# EAGLE design connector (EAGLE 9.6.2)
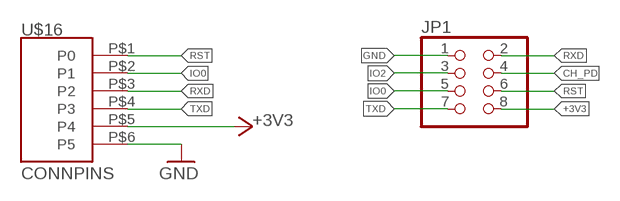
[diagram p0: schematic, sheet 1]

## Parts
JP1  PINHD-2X4  [2X04]
U$16  CONNPINS  [PINS]

## Nets
+3V3 [VCC]: JP1.8 U$16.P$5(P4)
CH_PD: JP1.4
GND [GND]: JP1.1 U$16.P$6(P5)
IO0: JP1.5 U$16.P$2(P1)
IO2: JP1.3
RST: JP1.6 U$16.P$1(P0)
RXD: JP1.2 U$16.P$3(P2)
TXD: JP1.7 U$16.P$4(P3)

## Library data of the parts
JP1 = pinhead:PINHD-2X4: PIN HEADER
U$16 = CONN:CONN

## Net classes
0 default: width 0.2 mm
1 VCC: width 0.25 mm
2 GND: width 0.3 mm
3 ANT: width 0.3 mm

## Board
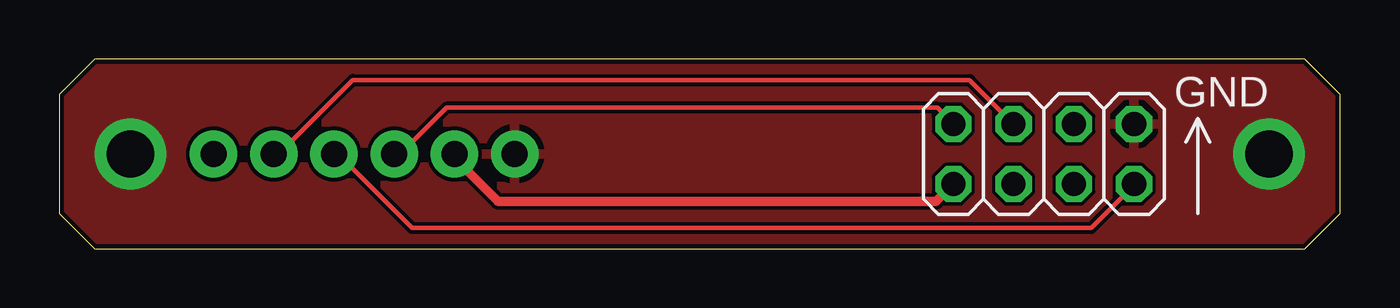
[diagram p1: board, top side]
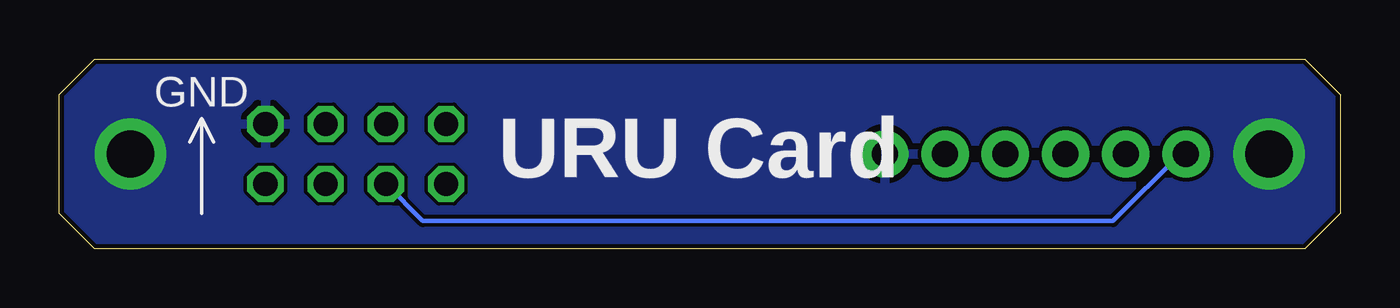
[diagram p2: board, bottom side, seen from below]

Size 54 x 8 mm. Coordinates in mm from the lower left corner, seen from the top.
Outline: 0,1.5 1.5,0 52.5,0 54,1.5 54,6.5 52.5,8 1.5,8 0,6.5 0,1.5
Copper layers (1*16): Top 0.035mm / dielectric 1.5mm / Bottom 0.035mm
Design rules "pcbway-5mil": minimum track width 6mil, minimum drill 0.3mm, track to track 6mil, track to pad 6mil, pad to pad 6mil, via to via 6mil, smd to smd 6mil, copper to edge 0.2mm, drill to drill 6mil, minimum pad ring 3mil, minimum via ring 3mil, stop-mask expansion 4mil, vias tented up to drill 0.5mm, thermal gap 10mil

### Footprints (pad centres in the part's own frame; a part is rotated, then mirrored left to right if it is on the bottom)
2X04 = drill 1.016 octagon: 1 -3.81,-1.27; 2 -3.81,1.27; 3 -1.27,-1.27; 4 -1.27,1.27; 5 1.27,-1.27; 6 1.27,1.27; 7 3.81,-1.27; 8 3.81,1.27
PINS = drill 1.1 pad 2: P$1 0,0; P$2 2.54,0; P$3 5.08,0; P$4 7.62,0; P$5 10.16,0; P$6 12.7,0

### Placement (x,y rotation side)
JP1  41.5,4 180 top
U$16  6.5,4 0 top

### Tracks (layer width: path | path; a pad name or v marks a point on that pad's centre or on a via)
+3V3
  Top 0.4: JP1.8 36.96,2 18.5,2 16.66,3.84 U$16.P$5
GND  (via drill 2)
  other vias: 3,4 51,4
  pour Top: -1,-1 54,-1 54,9.5 -1,9.5
  pour Bottom: -1,-1 54,-1 54,8.5 -1,8.5
IO0
  Top 0.2: JP1.5 38.38,7.12 12.38,7.12 9.25,4 U$16.P$2
RST
  Bottom 0.2: JP1.6 38.67,1.18 9.57,1.18 6.75,4 U$16.P$1
RXD
  Top 0.2: U$16.P$3 11.75,4 14.88,0.88 43.5,0.88 45.25,2.62 JP1.2
TXD
  Top 0.2: JP1.7 37.01,5.95 16.32,5.95 14.38,4 U$16.P$4

### Text on the board
tPlace: GND
bPlace: GND | URU Card